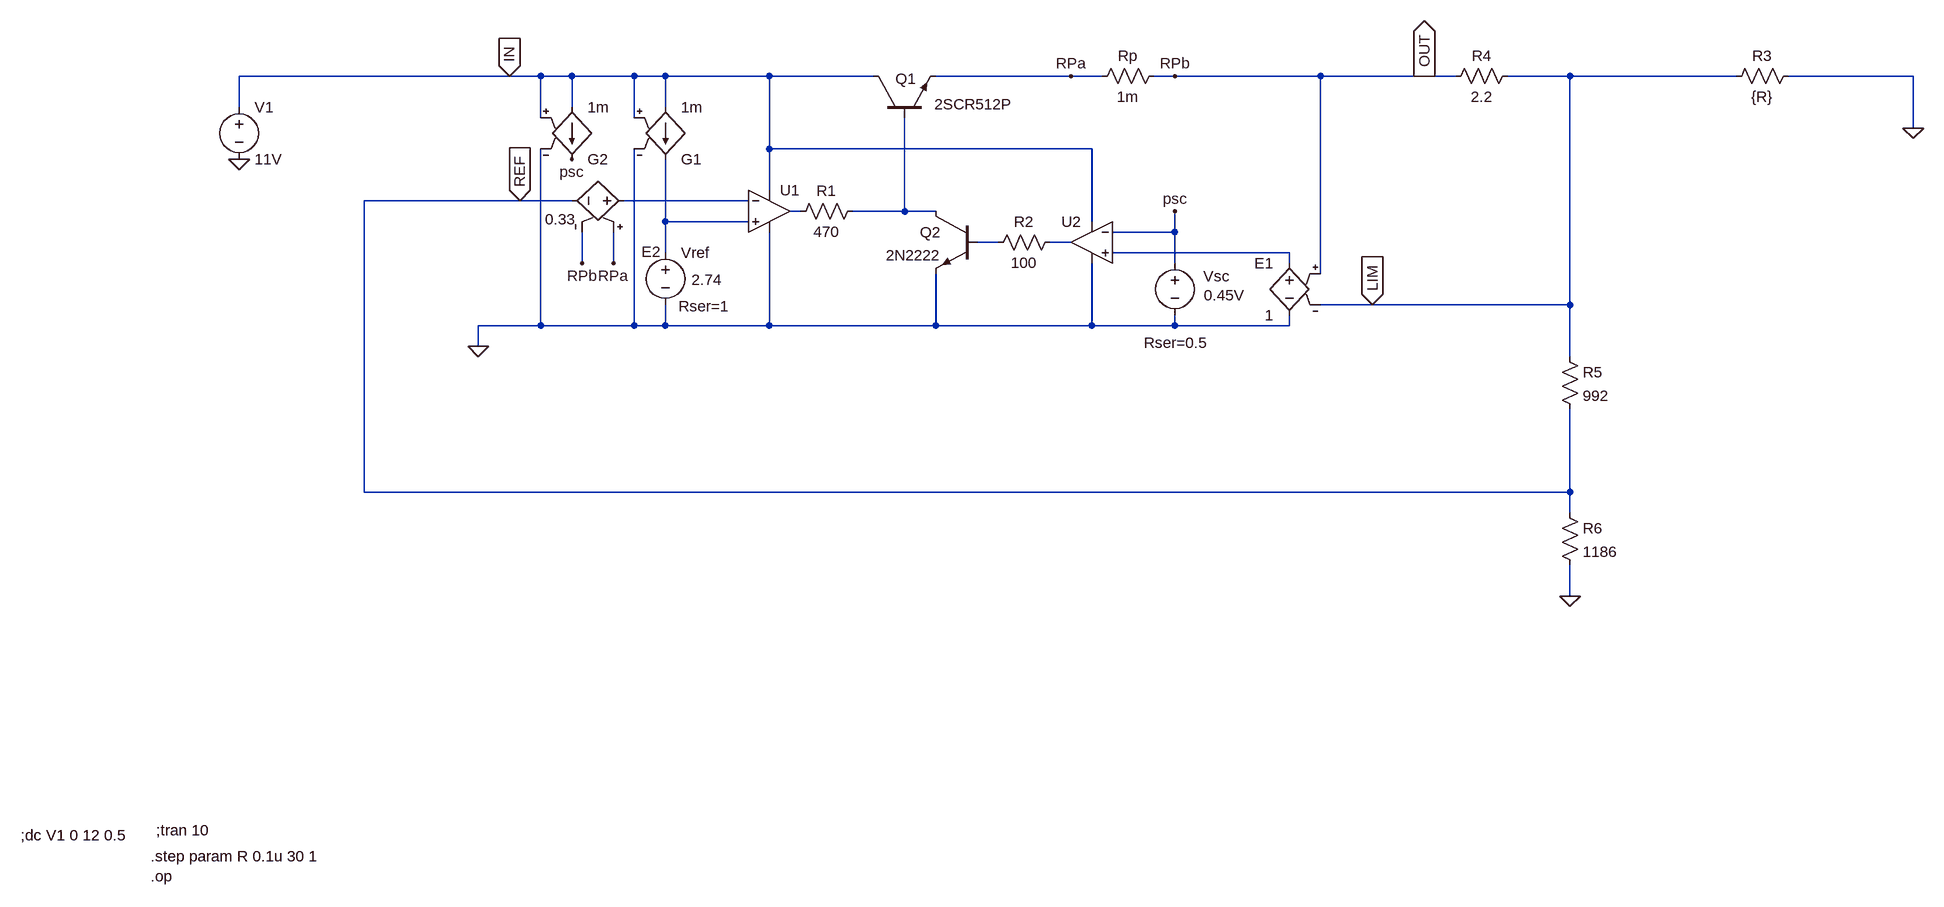
[diagram p0: schematic lab4Scheme.asc]
lab4Scheme.asc, the LTspice schematic file:
Version 4
SHEET 1 900 988
WIRE -1280 -256 -1696 -256
WIRE -1232 -256 -1280 -256
WIRE -1184 -256 -1232 -256
WIRE -1088 -256 -1184 -256
WIRE -1040 -256 -1088 -256
WIRE -880 -256 -1040 -256
WIRE -720 -256 -880 -256
WIRE -416 -256 -624 -256
WIRE -368 -256 -416 -256
WIRE -256 -256 -288 -256
WIRE -32 -256 -256 -256
WIRE 128 -256 -32 -256
WIRE 176 -256 128 -256
WIRE 352 -256 256 -256
WIRE 608 -256 352 -256
WIRE 880 -256 688 -256
WIRE -1696 -208 -1696 -256
WIRE -1184 -208 -1184 -256
WIRE -1040 -208 -1040 -256
WIRE -1232 -192 -1232 -256
WIRE -1088 -192 -1088 -256
WIRE 880 -176 880 -256
WIRE -880 -144 -880 -256
WIRE -384 -144 -880 -144
WIRE -880 -80 -880 -144
WIRE -1264 -64 -1504 -64
WIRE -1184 -64 -1264 -64
WIRE -912 -64 -1104 -64
WIRE -832 -48 -848 -48
WIRE -672 -48 -672 -192
WIRE -672 -48 -752 -48
WIRE -624 -48 -672 -48
WIRE -1040 -32 -1040 -128
WIRE -912 -32 -1040 -32
WIRE -384 -32 -384 -144
WIRE -256 -16 -256 -48
WIRE -256 -16 -352 -16
WIRE -528 0 -560 0
WIRE -416 0 -448 0
WIRE -1040 16 -1040 -32
WIRE -80 16 -352 16
WIRE -1168 32 -1168 -16
WIRE -1120 32 -1120 -16
WIRE -256 32 -256 -16
WIRE -80 32 -80 16
WIRE -32 48 -32 -256
WIRE 48 96 -32 96
WIRE 352 96 352 -256
WIRE 352 96 48 96
WIRE -1232 128 -1232 -144
WIRE -1232 128 -1328 128
WIRE -1088 128 -1088 -144
WIRE -1088 128 -1232 128
WIRE -1040 128 -1040 96
WIRE -1040 128 -1088 128
WIRE -880 128 -880 -16
WIRE -880 128 -1040 128
WIRE -624 128 -624 48
WIRE -624 128 -880 128
WIRE -384 128 -384 32
WIRE -384 128 -624 128
WIRE -256 128 -256 112
WIRE -256 128 -384 128
WIRE -80 128 -80 112
WIRE -80 128 -256 128
WIRE -1328 160 -1328 128
WIRE 352 176 352 96
WIRE -1504 384 -1504 -64
WIRE 352 384 352 256
WIRE 352 384 -1504 384
WIRE 352 416 352 384
WIRE 352 544 352 496
FLAG -1280 -256 IN
IOPIN -1280 -256 In
FLAG 128 -256 OUT
IOPIN 128 -256 Out
FLAG 48 96 LIM
IOPIN 48 96 In
FLAG -1264 -64 REF
IOPIN -1264 -64 In
FLAG -1184 -128 psc
FLAG -256 -48 psc
FLAG -416 -256 RPa
FLAG -256 -256 RPb
FLAG -1120 32 RPa
FLAG -1168 32 RPb
FLAG -1328 160 0
FLAG -1696 -128 0
FLAG 352 544 0
FLAG 880 -176 0
SYMBOL res -736 -64 R90
WINDOW 0 0 56 VBottom 2
WINDOW 3 32 56 VTop 2
SYMATTR InstName R1
SYMATTR Value 470
SYMBOL res -432 -16 R90
WINDOW 0 0 56 VBottom 2
WINDOW 3 32 56 VTop 2
SYMATTR InstName R2
SYMATTR Value 100
SYMBOL npn -560 -48 M0
SYMATTR InstName Q2
SYMATTR Value 2N2222
SYMBOL Opamps\\UniversalOpamp2 -880 -48 R0
SYMATTR InstName U1
SYMBOL Opamps\\UniversalOpamp2 -384 0 M0
SYMATTR InstName U2
SYMBOL voltage -256 16 R0
WINDOW 0 44 36 Left 2
WINDOW 3 45 65 Left 2
WINDOW 123 0 0 Left 0
WINDOW 39 -48 138 Left 2
SYMATTR InstName Vsc
SYMATTR Value 0.45V
SYMATTR SpiceLine Rser=0.5
SYMBOL npn -720 -192 R270
WINDOW 0 60 34 VRight 2
WINDOW 3 21 94 VRight 2
SYMATTR InstName Q1
SYMATTR Value 2SCR512P
SYMBOL voltage -1040 0 R0
WINDOW 123 0 0 Left 0
WINDOW 39 20 98 Left 2
WINDOW 3 40 57 Left 2
SYMATTR SpiceLine Rser=1
SYMATTR Value 2.74
SYMATTR InstName Vref
SYMBOL e -80 16 M0
SYMATTR InstName E1
SYMATTR Value 1
SYMBOL g2 -1040 -112 M180
SYMATTR InstName G1
SYMATTR Value 1m
SYMBOL g2 -1184 -112 M180
SYMATTR InstName G2
SYMATTR Value 1m
SYMBOL res -272 -272 R90
WINDOW 0 0 56 VBottom 2
WINDOW 3 32 56 VTop 2
SYMATTR InstName Rp
SYMATTR Value 1m
SYMBOL e -1088 -64 M270
WINDOW 0 -78 -11 VLeft 2
WINDOW 3 -28 137 VLeft 2
SYMATTR InstName E2
SYMATTR Value 0.33
SYMBOL voltage -1696 -224 R0
WINDOW 123 0 0 Left 0
WINDOW 39 0 0 Left 0
SYMATTR InstName V1
SYMATTR Value 11V
SYMBOL res 160 -240 R270
WINDOW 0 32 56 VTop 2
WINDOW 3 0 56 VBottom 2
SYMATTR InstName R4
SYMATTR Value 2.2
SYMBOL res 336 160 R0
SYMATTR InstName R5
SYMATTR Value 992
SYMBOL res 336 400 R0
SYMATTR InstName R6
SYMATTR Value 1186
SYMBOL res 704 -272 R90
WINDOW 0 0 56 VBottom 2
WINDOW 3 32 56 VTop 2
SYMATTR InstName R3
SYMATTR Value {R}
TEXT -1824 904 Left 2 !;tran 10
TEXT -2032 912 Left 2 !;dc V1 0 12 0.5
TEXT -1832 944 Left 2 !.step param R 0.1u 30 1\n.op

The netlist it stands for:
* lab4Scheme.asc
R1 N003 N002 470
R2 N006 N005 100
Q2 N003 N005 0 0 2N2222
XU1 N004 N001 IN 0 N002 level.2 Avol=1Meg GBW=10Meg Slew=10Meg ilimit=25m rail=0 Vos=0 phimargin=45 en=0 enk=0 in=0 ink=0 Rin=500Meg  ; pins IN+ IN- V+ V- OUT
XU2 N007 psc IN 0 N006 level.2 Avol=1Meg GBW=10Meg Slew=10Meg ilimit=25m rail=0 Vos=0 phimargin=45 en=0 enk=0 in=0 ink=0 Rin=500Meg  ; pins IN+ IN- V+ V- OUT
Vsc psc 0 0.45V Rser=0.5
Q1 IN N003 RPa 0 2SCR512P
Vref N004 0 2.74 Rser=1
E1 N007 0 RPb LIM 1
G1 IN N004 IN 0 1m
G2 IN psc IN 0 1m
Rp RPb RPa 1m
E2 N001 REF RPa RPb 0.33
V1 IN 0 11V
R4 RPb LIM 2.2
R5 LIM REF 992
R6 REF 0 1186
R3 0 LIM {R}
.model NPN NPN
.model PNP PNP
.lib standard.bjt
;tran 10
;dc V1 0 12 0.5
.step param R 0.1u 30 1
.op
.lib UniversalOpamps2.sub
.backanno
.end